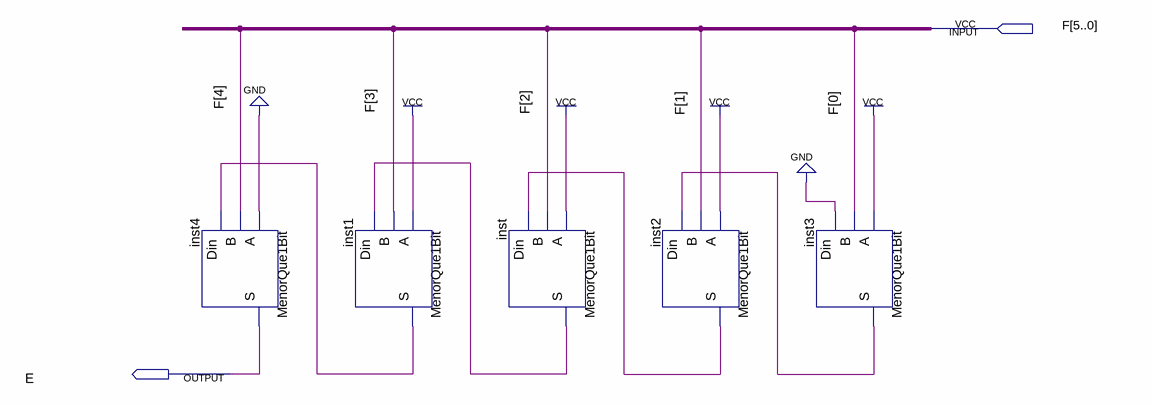
[diagram p0: schematic sheet]
// Quartus schematic MaiorQue15.bdf as structural Verilog: 5 symbols, 2 pins
module MaiorQue15 (
  input  [5:0] F,
  output E
);

  wire inst1_s, inst2_s, inst3_s, inst_s;

  MenorQue1Bit inst4 (.A(1'b0), .B(F[4]), .Din(inst1_s), .S(E));
  MenorQue1Bit inst1 (.A(1'b1), .B(F[3]), .Din(inst_s), .S(inst1_s));
  MenorQue1Bit inst (.A(1'b1), .B(F[2]), .Din(inst2_s), .S(inst_s));
  MenorQue1Bit inst2 (.A(1'b1), .B(F[1]), .Din(inst3_s), .S(inst2_s));
  MenorQue1Bit inst3 (.A(1'b1), .B(F[0]), .Din(1'b0), .S(inst3_s));
endmodule
